# EAGLE design Adafruit SPA06-003 Temperature + Pressure Sensor (EAGLE 9.6.2)
COMPANY: ADAFRUIT INDUSTRIES; DRAWN: KTOWN; REV: A
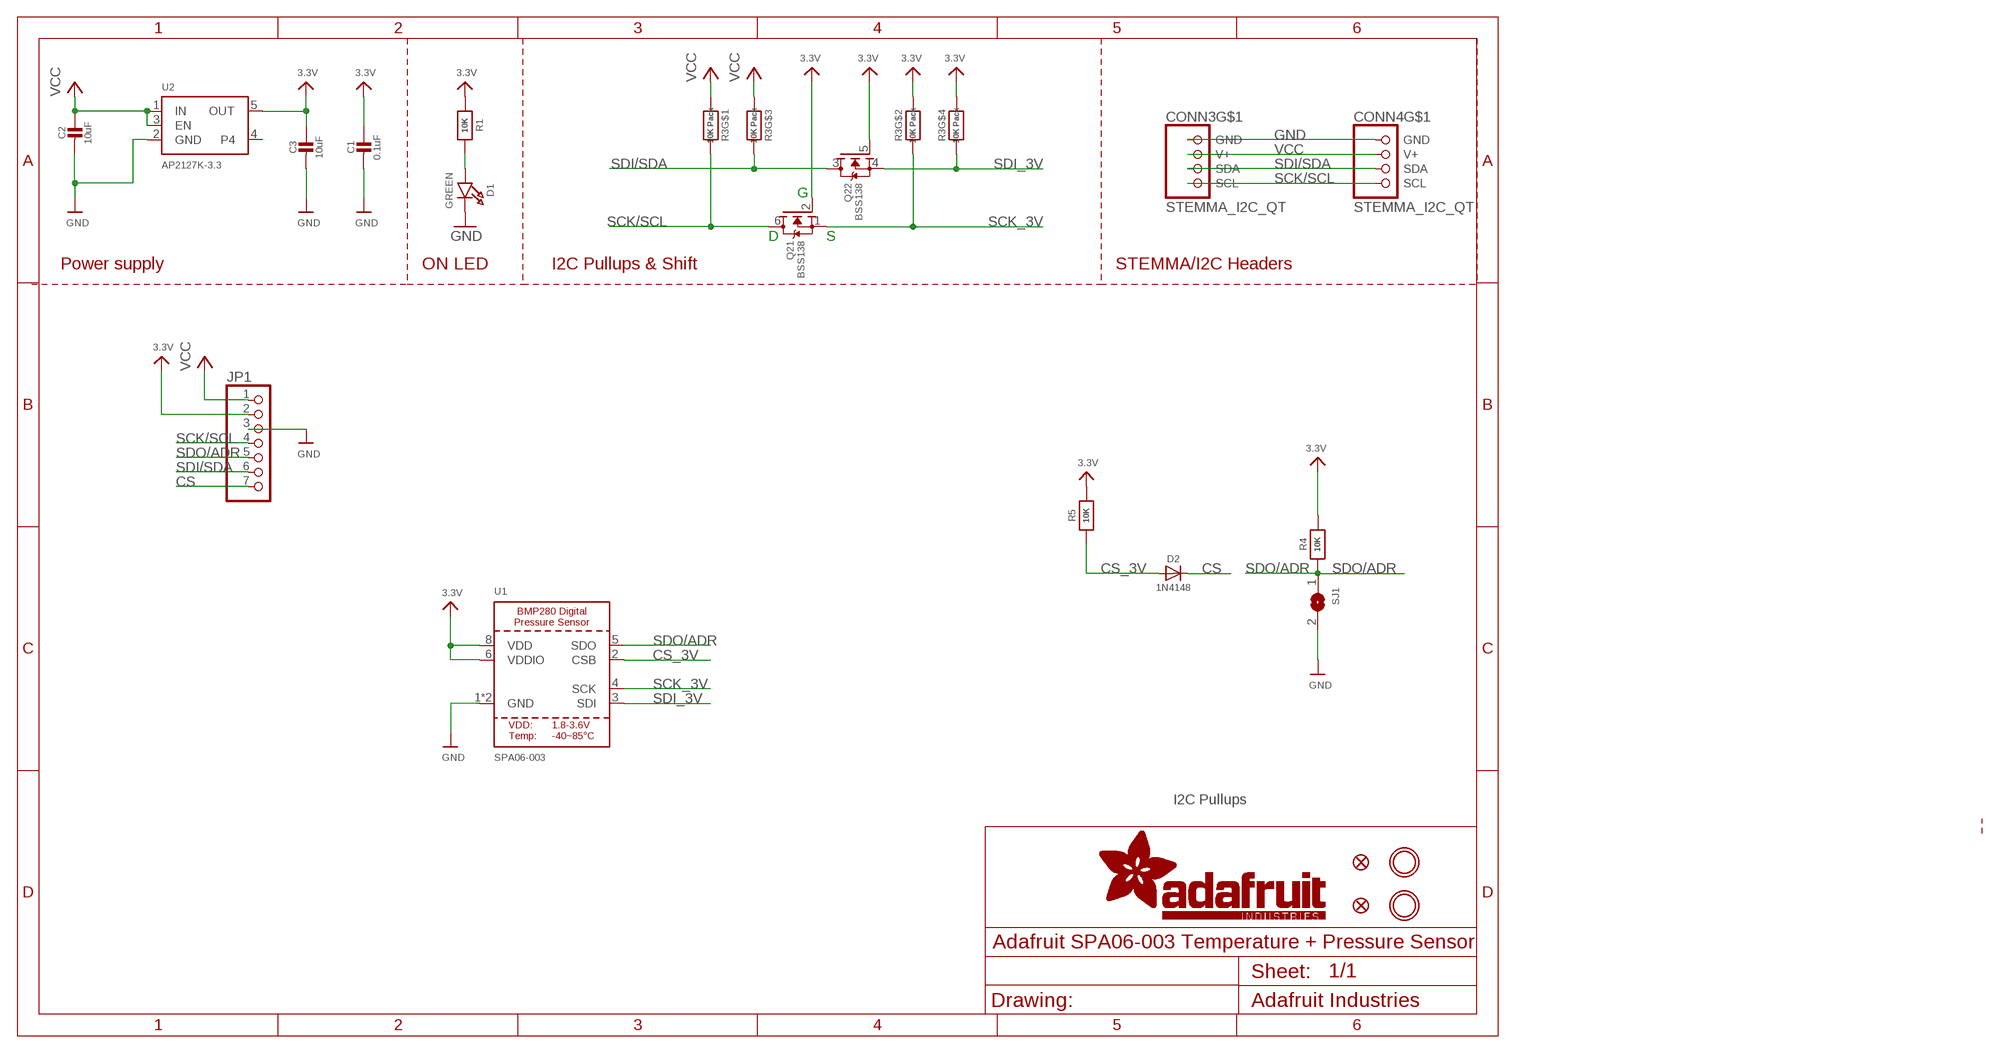
[diagram p0: schematic, sheet 1]

## Parts
C1  0.1uF  CAP_CERAMIC0603_NO  [0603-NO]
C2  10uF  CAP_CERAMIC0805-NOOUTLINE  [0805-NO]
C3  10uF  CAP_CERAMIC0805-NOOUTLINE  [0805-NO]
CONN3  STEMMA_I2C_QT  [JST_SH4]
CONN4  STEMMA_I2C_QT  [JST_SH4]
D1  GREEN  LED0603_NOOUTLINE  [CHIPLED_0603_NOOUTLINE]
D2  1N4148  DIODESOD-323  [SOD-323]
FID3  FIDUCIAL_0.5MM  [FIDUCIAL_0.5MM]
FID4  FIDUCIAL_0.5MM  [FIDUCIAL_0.5MM]
JP1  HEADER-1X770MIL  [1X07_ROUND_70]
Q2  BSS138  MOSFET-N_DUAL  [SOT363]
R1  10K  RESISTOR_0603_NOOUT  [0603-NO]
R3  10K Pack  RESISTOR_4PACK  [RESPACK_4X0603]
R4  10K  RESISTOR_0603_NOOUT  [0603-NO]
R5  10K  RESISTOR_0603_NOOUT  [0603-NO]
SJ1  SOLDERJUMPER  [SOLDERJUMPER_ARROW_NOPASTE]
U1  SPA06-003  BMP280_COMBO  [BMX280_COMBO]
U2  AP2127K-3.3  VREG_SOT23-5  [SOT23-5]
U$1  MOUNTINGHOLE2.5  [MOUNTINGHOLE_2.5_PLATED]
U$17  MOUNTINGHOLE2.5  [MOUNTINGHOLE_2.5_PLATED]

## Nets
3.3V [lowpower]: C1.1 C3.1 JP1.2 Q2.2(1:G) Q2.5(2:G) R1.1 R3.2 R3.4 R4.2 R5.2 U1.6(VDDIO) U1.8(VDD) U2.5(OUT)
CS: D2.C JP1.7
CS_3V: D2.A R5.1 U1.2(CSB)
GND [highpower]: C1.2 C2.2 C3.2 CONN3.1(GND) CONN4.1(GND) D1.C JP1.3 SJ1.2 U1.1(GND) U1.7(GND) U2.2(GND)
N$1: D1.A R1.2
SCK/SCL: CONN3.4(SCL) CONN4.4(SCL) JP1.4 Q2.6(1:D) R3.8
SCK_3V: Q2.1(1:S) R3.7 U1.4(SCK)
SDI/SDA: CONN3.3(SDA) CONN4.3(SDA) JP1.6 Q2.3(2:D) R3.6
SDI_3V: Q2.4(2:S) R3.5 U1.3(SDI)
SDO/ADR: JP1.5 R4.1 SJ1.1 U1.5(SDO)
VCC [highpower]: C2.1 CONN3.2(V+) CONN4.2(V+) JP1.1 R3.1 R3.3 U2.1(IN) U2.3(EN)
Unconnected: CONN3.MT1(MT) CONN3.MT2(MT) CONN4.MT1(MT) CONN4.MT2(MT) U2.4

## Notes on the sheet
- G
- D | S
- Power supply | ON LED | I2C Pullups & Shift | STEMMA/I2C Headers
- I2C Pullups

## Library data of the parts
C1-C3 = microbuilder:CAP_CERAMIC: Ceramic Capacitors For new designs, use the packages preceded by an '_' character since they are more reliable: The following footprints should be used on most boards: _0402 - Standard footprint for regular board layouts _0603 - Standard footprint for regular board layouts _0805 - Standard footprint for regular board layouts _1206 - Standard footprint for regular board layouts For extremely tight-pitch boards where space is at a premium, the following 'micro-pitch' footprints can be used (smaller pads, no silkscreen outline, etc.): _0402MP - Micro-pitch footprint for very dense/compact boards _0603MP - Micro-pitch footprint for very dense/compact boards _0805MP - Micro-pitch footprint for very dense/compact boards _1206MP - Micro-pitch footprint for very dense/compact boards
CONN3 CONN4 = adafruit_electromech:STEMMA_I2C; LCSC: C2845363
D1 = microbuilder:LED: LED 0603 - 0603 Surface Mount Package 2mA: Green LED - Low Power (3.9mcd, 2ma, 1.7Vf) - Digikey: 475-2709-2-ND Orange LED - Low Power (9.8mcd, 2ma, 1.8Vf) - Digikey: 475-1194-2-ND Red LED - Low Power (5mcd, 2ma, 1.8Vf) - Digikey: 475-1195-2-ND Yellow LED - Low Power (7mcd, 2ma, 1.8Vf) - Digikey: 475-1196-2-ND 5mA: Blue LED - Low Power (17mcd, 5ma, 2.9Vf) - Digikey: LNJ937W8CRACT-ND 0805 - 0805 Surface Mount Package 2mA: Red LED (8.8mcd, 2mA, 1.8Vf, Clear) - Low Power [Digikey: 475-2510-1-ND] Green LED (5mcd, 2mA, 1.8Vf, Clear) - Low Power [Digikey: 475-2730-1-ND] Yellow LED (11.3mcd, 2mA, 1.8Vf, Clear) - Low Power [Digikey: 475-2555-1-ND] 20mA: Red LED (104mcd, 20mA, Diffused) - LS R976 [Digikey: 475-1278-6-ND] Red LED (12mcd, 20mA, 2.0Vf, Clear) - APT2012EC [Digikey: 754-1128-1-ND] Green LED (15mcd, 20mA, 2.2Vf, Clear) - APT2012GC [Digikey: 754-1131-1-ND] Orange LED (160mcd, 20mA, 2.1Vf, Clear) - APT2012SECK [Digikey: 754-1130-1-ND] 1206 - 1206 Surface Mount Package Green LED (26mcd, 20mA, Diffused) - LG N971 [Digikey: 475-1407-6-ND] Red LED (15mcd, 20mA, Diffused) - LH N974 [Digikey: 475-1416-6-ND] Cree - Cree High-Power Surface Mount LEDs XPEBWT-L1-0000-00D50 - White 111lm 350mA 2.9Vf 6200K 110° XTEAWT-00-0000-00000LEE3 - White 114lm 350mA 2.85Vf 5000K 115° Everlight - Everlight 45-21 Series Surface Mount LEDs 45-21/QK2C-B2832AC2CB2/2T - Warm White 2000mcd 20mA 3.25Vf 3050K 120° 45-21/LK2C-B38452C4CB2/2T - Nuetral White 2000mcd 20mA 3.25Vf 4150K 120° 45-21/LK2C-B50634C6CB2/2T - Cold White 2200mcd 20mA 3.25Vf 5650K 120° PLCC2 Reverse Mount LS T77K-J1L2-1-0-2-R18-Z - Red 11.25mcd 2mA 1.8Vf 630nm 120° LO T77K-L1M2-24-Z - Orange 19.6mcd 2mA 1.8Vf 606nm 120° LY T77K-K2M1-26-Z - Yellow 15.7mcd 2mA 1.8Vf 587nm 120°; ROT: 270
D2 = microbuilder:DIODE: Diode SMA Model Volts Amps Type Vf Ir Digikey # Notes SSA34-E3 40V 3A Schottky 480mV @ 3A 200uA @ 40V SSA34-E3/61TGITR-ND CDBA120-G 20V 1A Schottky 500mV @ 1A 500uA @ 20V 641-1014-6-ND REEL MBRA210 10V 2A Schottky 350mV @ 2A 700uA @ 10V MBRA210LT3 SOD-123 Model Volts Amps Type Vf Ir Order # Notes BAT54T1G 30V 200mA Schottky 800mV @ 200mA 2uA @ 25V BAT54T1GOSTR-ND B0530W 30V 500mA Schottky 430mV @ 500mA 130uA @ 30V B0530W-FDICT-ND REEL MBR120 20V 1A Schottky 340mV @ 1A MBR120VLSFT1GOSCT-ND SOD-323 Model Volts Amps Type Vf Ir Order # Notes PMEG2005EJ 20V 500mA Schottky 355mV @ 500mA 568-4110-1-ND ZLLS410 10V 570mA Schottky 380mV @ 570mA ZLLS410CT-ND 1N4148WS 75V 150mA Silicon/Simple 1V 1N4148WSFSCT-ND REEL SOD-523 Model Volts Amps Type Vf Ir Order # Notes BAT54XV2 30V 200mA Schottky 0.8V @ 100mA BAT54XV2CT-ND TB751S 30V 30mA Schottky RB751S-40TE61CT-ND SOT23-R/W (R = Solder Paste/Reflow Ovens, W = Hand-Soldering) Model Volts Amps Type Vf Ir Order # Notes BAT54FILM 40V 300mA Schottky 497-7162-1-ND POWERDI-5 Model Volts Amps Type Vf Ir Order # Notes PDS560 60V 5A Schottky 670mV @ 5A 150uA @ 60V PDS560DICT-ND
FID3 FID4 = microbuilder:FIDUCIAL: Fiducial Alignment Points Various fiducial points for machine vision alignment.
JP1 = microbuilder:HEADER-1X7: PIN HEADER
Q2 = microbuilder:MOSFET-N_DUAL: Dual N-Channel MOSFET SOT363 (2.0x1.25mm) 2N7002PS - 60V, 320mA [Digikey: 568-5984-1-ND]; JLC_ROTATION: 270
R1 R4 R5 = microbuilder:RESISTOR: Resistors For new designs, use the packages preceded by an '_' character since they are more reliable: The following footprints should be used on most boards: _0402 - Standard footprint for regular board layouts _0603 - Standard footprint for regular board layouts _0805 - Standard footprint for regular board layouts _1206 - Standard footprint for regular board layouts For extremely tight-pitch boards where space is at a premium, the following 'micro-pitch' footprints can be used (smaller pads, no silkscreen outline, etc.): _0402MP - Micro-pitch footprint for very dense/compact boards _0603MP - Micro-pitch footprint for very dense/compact boards _0805MP - Micro-pitch footprint for very dense/compact boards _1206MP - Micro-pitch footprint for very dense/compact boards
R3 = microbuilder:RESISTOR_4PACK: Resistor Packs (4 resistors) 4 x 0603 10K 1/16W - Digikey: YC164J-10KCT-ND
SJ1 = microbuilder:SOLDERJUMPER: SMD Solder JUMPER Solder the two pads together to create a connection, or remove the solder to break it. REFLOW - Use this footprint for solder paste and reflow ovens. WAVE - Use this footprint for hand-soldering (larger pads). CLOSED - Has a trace between the two pads to ensure it is closed by default. The trace needs to be cut to disable the jumper, and can be closed again by creating a solder bridge between the two pads.; BOM: EXCLUDE
U1 = adafruit_sensor:BMP280: BMP280 - Digital Pressure Sensor Operating Pressure Range: 300-1100 hPa Pressure Resolution: 0.16Pa RMS Noise: 1.3Pa Temperature Resolution: 0.01 C
U2 = adafruit_power:VREG_SOT23-5: SOT23-5 Fixed Voltage Regulators Part Current Out V Out V In V Dropout θJA (°C/W) TJ (°C) Digikey Part No. ADP121 150mA 3.3V 3.4-5.5V 0.09V @ 150mA -- -- ADP121-AUJZ33R7CT-ND ADP121 150mA 3.0V 3.1-5.5V 0.09V @ 150mA -- -- ADP121-AUJZ30R7CT-ND ADP122 300mA 3.3V 3.4-5.5V 0.085V @ 300mA -- -- ADP122AUJZ-3.3-R7CT-ND ADP1712 300mA 3.3V 3.5-5.5V 0.17V @ 300mA -- -- ADP1712AUJZ-3.3-R7TR-ND AP7311 (Low Cost) 150mA 3.3V 3.5-6V 0.15V @ 150mA -- -- AP7311-33WG-7DICT-ND LD39015M18R 150mA 1.8V 1.9V-5.5V 0.08V @ 100mA -- -- 497-6977-1-ND LP2985A-33DBVR 150mA 3.3V 3.3-16V 0.28V @ 150mA 206 150 296-18479-1-ND MCP1824T-3302E/OT 300mA 3.3V 3.5V-6V 0.2V @ 300mA -- -- MCP1824T-3302E/OTCT-ND MIC5205-2.5YM5 TR 150mA 2.5V 2.7-16V 0.165V @ 150mA -- -- 576-1257-2-ND MIC5205-3.0YM5 TR 150mA 3.0V 3.2V-16V 0.165V @ 150mA -- -- 576-1258-2-ND MIC5205-3.3YM5 TR 150mA 3.3V 3.5V-16V 0.165V @ 150mA -- -- 576-1259-2-ND TPS780330220 150mA 3.3V+2.2V 3.6-5.5V 250mV Max -- -- 296-23332-1-ND TDA3663/N1,135 100mA 3.3V 3.5-45V 0.18V @ 50mA -- -- 568-5343-1-ND Max operating temp can be calculated using θJA, TJ (max junction temperature), and power in watts. Set the "Maximum Ambient Temperature" until it reaches TJ ("Max Junction Temperature"), which is the absolute limit for safe use of the regulator: Heat Sink Temperature Calculator <http://www.daycounter.com/Calculators/Heat-Sink-Temperature-Calculator.phtml> For example, With 12V source into a 3.3V LP2985 and a 30mA load, we are dissipating (12V-3.3V) * 0.03A = 0.261W. With a θJA of 206 °C/W, a TJ of 150°C, and 261mW we can safely use the chip without a heat sink up to 75°C (=147.1°C Junction Temperature).; JLC_ROTATION: 270
U$1 U$17 = adafruit_electromech:MOUNTINGHOLE: Mounting Hole For #2 screws (0.086"/2.18mm width, 0.094"/2.4mm hole) use 2.5mm; BOM: EXCLUDE

## Net classes
1 highpower: width 0.305 mm, drill 0.483 mm
2 lowpower: width 0.305 mm, drill 0.483 mm

## Board
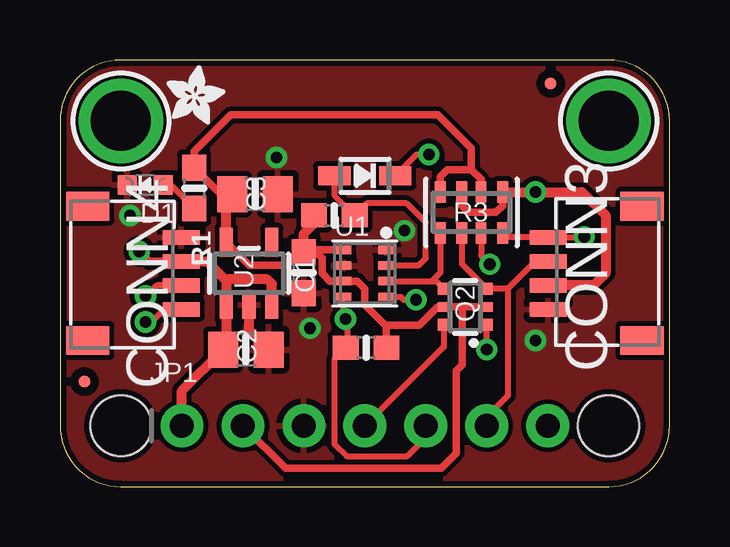
[diagram p1: board, top side]
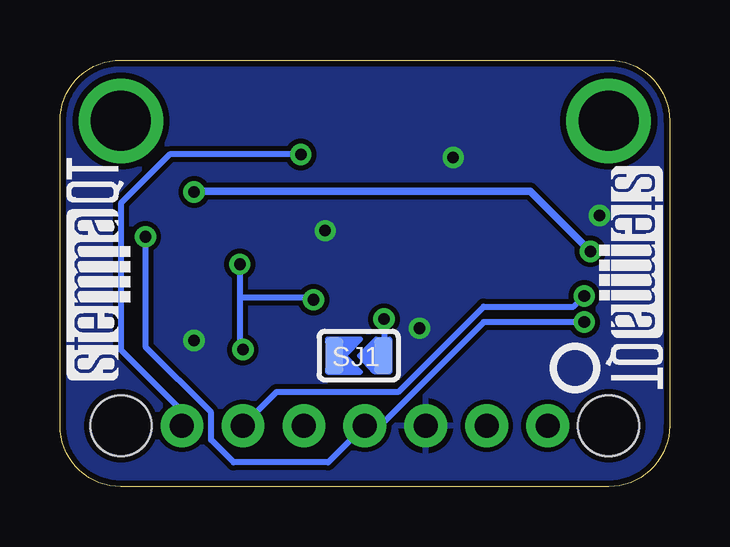
[diagram p2: board, bottom side, seen from below]

Size 25.4 x 17.78 mm. Coordinates in mm from the lower left corner, seen from the top.
Outline: 0,15.24 0,2.54 arc90 2.54,0 22.86,0 arc90 25.4,2.54 25.4,15.24 arc90 22.86,17.78 2.54,17.78 arc90 0,15.24
Copper layers (1*16): Top 0.035mm / dielectric 1.5mm / Bottom 0.035mm
Design rules "adafruit *": minimum track width 8mil, minimum drill 15.5mil, track to track 8mil, track to pad 8mil, pad to pad 8mil, via to via 8mil, smd to smd 8mil, copper to edge 10mil, drill to drill 8mil, minimum pad ring 10mil, minimum via ring 8mil, stop-mask expansion 2mil, vias tented up to drill 20mil, thermal gap 10mil
Holes 2.54 mm at 2.54,2.54 22.86,2.54

### Footprints (pad centres in the part's own frame; a part is rotated, then mirrored left to right if it is on the bottom)
0603-NO = smd 1.075 x 1: 1 -0.85,0; 2 0.85,0
0805-NO = smd 1.24 x 1.5: 1 -0.95,0; 2 0.95,0
JST_SH4 = smd 0.6 x 1.55: 1 -1.5,2.006; 2 -0.5,2.006; 3 0.5,2.006; 4 1.5,2.006 | smd 1.2 x 1.8: MT1 -2.8,-1.894; MT2 2.8,-1.894
CHIPLED_0603_NOOUTLINE = smd 0.8 x 0.8: A 0,-0.75; C 0,0.75
SOD-323 = smd 1.35 x 0.8: A 1.27,0; C -1.27,0
FIDUCIAL_0.5MM = smd 0.5 x 0.5: 1 0,0
1X07_ROUND_70 = drill 1 pad 1.778: 1 -7.62,0; 2 -5.08,0; 3 -2.54,0; 4 0,0; 5 2.54,0; 6 5.08,0; 7 7.62,0
SOT363 = smd 0.5 x 0.5: 1 -0.75,-0.9; 3 0.75,-0.9; 4 0.75,0.9; 6 -0.75,0.9 | smd 0.4 x 0.5: 2 0,-0.9; 5 0,0.9
RESPACK_4X0603 = smd 0.45 x 0.9: 1 -1.3,-0.85; 2 -0.4,-0.85; 3 0.4,-0.85; 4 1.3,-0.85; 5 1.3,0.85; 6 0.4,0.85; 7 -0.4,0.85; 8 -1.3,0.85
SOLDERJUMPER_ARROW_NOPASTE = smd 0.762 x 1.524: 1 -1.016,0; 2 1.016,0
BMX280_COMBO = smd 0.725 x 0.35: 1 0.925,0.975; 2 0.925,0.325; 3 0.925,-0.325; 4 0.925,-0.975; 5 -0.925,-0.975; 6 -0.925,-0.325; 7 -0.925,0.325; 8 -0.925,0.975
SOT23-5 = smd 0.55 x 1.2: 1 -0.95,-1.3; 2 0,-1.3; 3 0.95,-1.3; 4 0.95,1.3; 5 -0.95,1.3
MOUNTINGHOLE_2.5_PLATED = drill 2.5 pad 3.2: P$1 0,0

### Placement (x,y rotation side)
C1  10.16,8.92 270 top
C2  7.75,5.71 0 top
C3  8.13,12.19 0 top
CONN3  22.35,8.89 90 top
CONN4  3.05,8.89 270 top
D1  3.56,12.57 90 top
D2  12.7,12.95 180 top
FID3  1.02,4.38 0 top
FID4  20.45,16.8 0 top
JP1  12.7,2.54 0 top
PLABEL0  [PLABEL0]  5.21,0.89 0 top
PLABEL1  [PLABEL1]  7.75,4.19 0 top
PLABEL2  [PLABEL2]  10.29,0.89 0 top
PLABEL3  [PLABEL3]  12.7,4.19 0 top
PLABEL4  [PLABEL4]  17.78,4.19 0 top
PLABEL5  [PLABEL5]  12.83,14.61 0 top
PLABEL6  [PLABEL6]  0.25,12.45 0 top
PLABEL7  [PLABEL7]  20.45,0.89 0 top
PLABEL8  [PLABEL8]  15.37,0.89 0 top
PLABEL10  [PLABEL10]  12.83,16.26 0 bottom
PLABEL11  [PLABEL11]  12.45,11.56 0 bottom
PLABEL12  [PLABEL12]  12.7,0.76 0 bottom
PLABEL13  [PLABEL13]  9.14,5.33 0 bottom
PLABEL14  [PLABEL14]  12.95,7.24 0 bottom
PLABEL15  [PLABEL15]  13.46,16.38 0 top
Q2  16.89,7.49 90 top
R1  5.59,12.45 270 top
R3  17.14,11.43 180 top
R4  12.75,5.79 0 top
R5  11.43,11.3 180 top
SJ1  12.95,5.46 180 bottom
U1  12.7,8.89 0 top
U2  7.87,8.89 0 top
U$1  2.54,15.24 0 top
U$4  [ADAFRUIT_2.5MM]  4.45,15.11 0 top
U$17  22.86,15.24 0 top
U$25  [PCBFEAT-REV-040]  3.94,4.95 0 bottom
U$30  [STEMMAQT]  22.48,4.45 90 bottom
U$31  [STEMMAQT]  2.92,13.34 270 bottom

### Tracks (layer width: path | path; a pad name or v marks a point on that pad's centre or on a via)
3.3V
  Top 0.305: C3.1 6.69,12.19 R1.1 5.59,13.97 7.11,15.49 15.75,15.49 17.14,14.1 17.14,13.21 | 16.76,7.49 Q2.5 15.97,7.48 15.72,7.48 14.98,6.73 13.65,6.73 13.6,6.68 | 16.76,7.49 Q2.2 | U2.5 7.88,9.23 9.38,9.23 9.91,9.77 C1.1 | C1.1 10.68,9.77 10.92,9.53 10.92,8.89 11.25,8.56 U1.6 12.39,8.56 12.7,8.26 12.7,7.58 13.6,6.68 | JP1.2 9.4,0.76 15.88,0.76 16.51,1.4 16.51,4.83 16.76,5.08 16.76,7.49 | R3.2 17.55,12.81 17.14,13.21 | 17.14,13.21 16.13,13.21 15.85,12.92 R3.4 | R4.2 13.6,6.68 | U1.8 10.26,9.87 C1.1
  Top 0.406: U2.5 6.92,11.94 C3.1 | C1.1 10.16,10.54 10.58,10.96 R5.2
CS  (via drill 0.48)
  Top 0.254: D2.C 14.86,13.84 v15.37,13.84
  Bottom 0.254: v15.37,13.84 20.83,13.84 22.86,11.81 22.86,5.71 20.32,3.17 JP1.7
CS_3V
  Top 0.254: D2.A 11.43,12.15 R5.1 12.79,11.81 14.44,11.81 15.24,11.01 15.24,9.53 14.93,9.21 U1.2
GND  (via drill 0.48)
  Top 0.406: U2.2 7.87,6.54 C2.2
  other vias: 2.92,11.3 9.02,13.72 19.81,6.1 14.35,10.67 10.41,6.6
  pour Top: 0,17.78 25.4,17.78 25.4,0 0,0
  pour Bottom: 0,17.78 25.4,17.78 25.4,0 0,0
N$1
  Top 0.254: D1.A 4.61,12.57 R1.2
SCK/SCL  (via drill 0.48)
  Top 0.254: R3.8 18.64,10.39 CONN3.4 21.82,10.39 v21.84,10.41 | Q2.6 15.99,5.83 JP1.4 | CONN4.4 4.34,7.39 3.81,6.86 v3.56,6.86
  Bottom 0.254: v3.56,6.86 7.75,6.86 12.06,2.54 JP1.4 14.22,1.02 18.16,1.02 19.1,1.96 19.1,3.1 21.84,5.84 v21.84,10.41
SCK_3V  (via drill 0.48)
  Top 0.254: R3.7 17.55,9.63 v17.91,9.27 | v17.78,5.71 Q2.1 | v14.84,7.79 14.33,7.79 14.21,7.92 U1.4
  Bottom 0.254: v17.91,9.27 17.91,7.87 | 17.91,7.87 17.91,5.84 v17.78,5.71 | v14.84,7.79 14.92,7.87 17.91,7.87
SDI/SDA  (via drill 0.48)
  Top 0.254: R3.6 16.75,9.29 Q2.3 18.66,8.24 | CONN3.3 19.8,9.39 18.66,8.24 | JP1.6 17.78,2.92 18.67,3.81 18.67,8.23 18.66,8.24 | CONN4.3 4.04,8.39 3.6,7.95 v3.56,7.95
  Bottom 0.254: v3.56,7.95 4,7.51 7.75,7.51 11.31,3.94 16.38,3.94 JP1.6
SDI_3V
  Top 0.254: 15.49,8.56 15.67,8.56 Q2.4 | R3.5 15.85,8.92 15.49,8.56 | U1.3 15.49,8.56
SDO/ADR  (via drill 0.48)
  Top 0.203: U1.5 11.78,7.18 11.97,6.99
  Top 0.254: JP1.5 15.24,2.03 14.48,1.27 11.94,1.27 11.43,1.78 11.43,5.32 R4.1 11.97,5.87 11.97,6.99 v11.9,6.99
  Bottom 0.254: v11.9,6.99 11.9,5.5 SJ1.1
VCC  (via drill 0.48)
  Top 0.305: R3.3 16.75,11.7 17.02,11.43 18.16,11.43 18.45,11.71 R3.1 | CONN4.2 3.72,9.39 v3.3,9.8
  Top 0.406: JP1.1 5.08,4 C2.1 6.92,5.84 U2.1 6.92,8.57 | U2.3 8.82,8.45 8.64,8.64 6.99,8.64 6.92,8.57 | CONN4.2 6.11,9.39 6.92,8.57 | R3.1 v19.81,12.28 21.76,12.28 22.73,11.3 22.73,8.89 22.23,8.39 CONN3.2
  Bottom 0.305: v3.3,9.8 5.82,12.32 19.81,12.32 v19.81,12.28

### Text on the board
Pinguin_tBackup: SPA06-003 | SPA06-003 | Temperature+Pressure | on | 3Vo | SCK | SDI | VIN | GND | SDO | CS
Pinguin_bBackup: SPA06-003 | Temperature / & Barometric / Pressure Sensor | Default I2C Addr 0x77 | Addr | VLogic/Vcc: 3-5VDC